# Altium schematic sheet РЕУН.468172.001_Step-Down_Controller.SchDoc: =Name-1str
size 594 x 420 mm; SheetNumber: 3; Вид изделия: Документация; Раздел: Документация; Код документа: Э3; Вид документа: Схема электрическая принципиальная; Класс документа: Конструкторский документ; Создавать изделие в PLM: Yes; DocumentCode: РЕУН.468172.001Э3; DocumentView: Схема электрическая принципиальная; DocumentClass: Конструкторский документ; ProductView: Документация; Format: А2
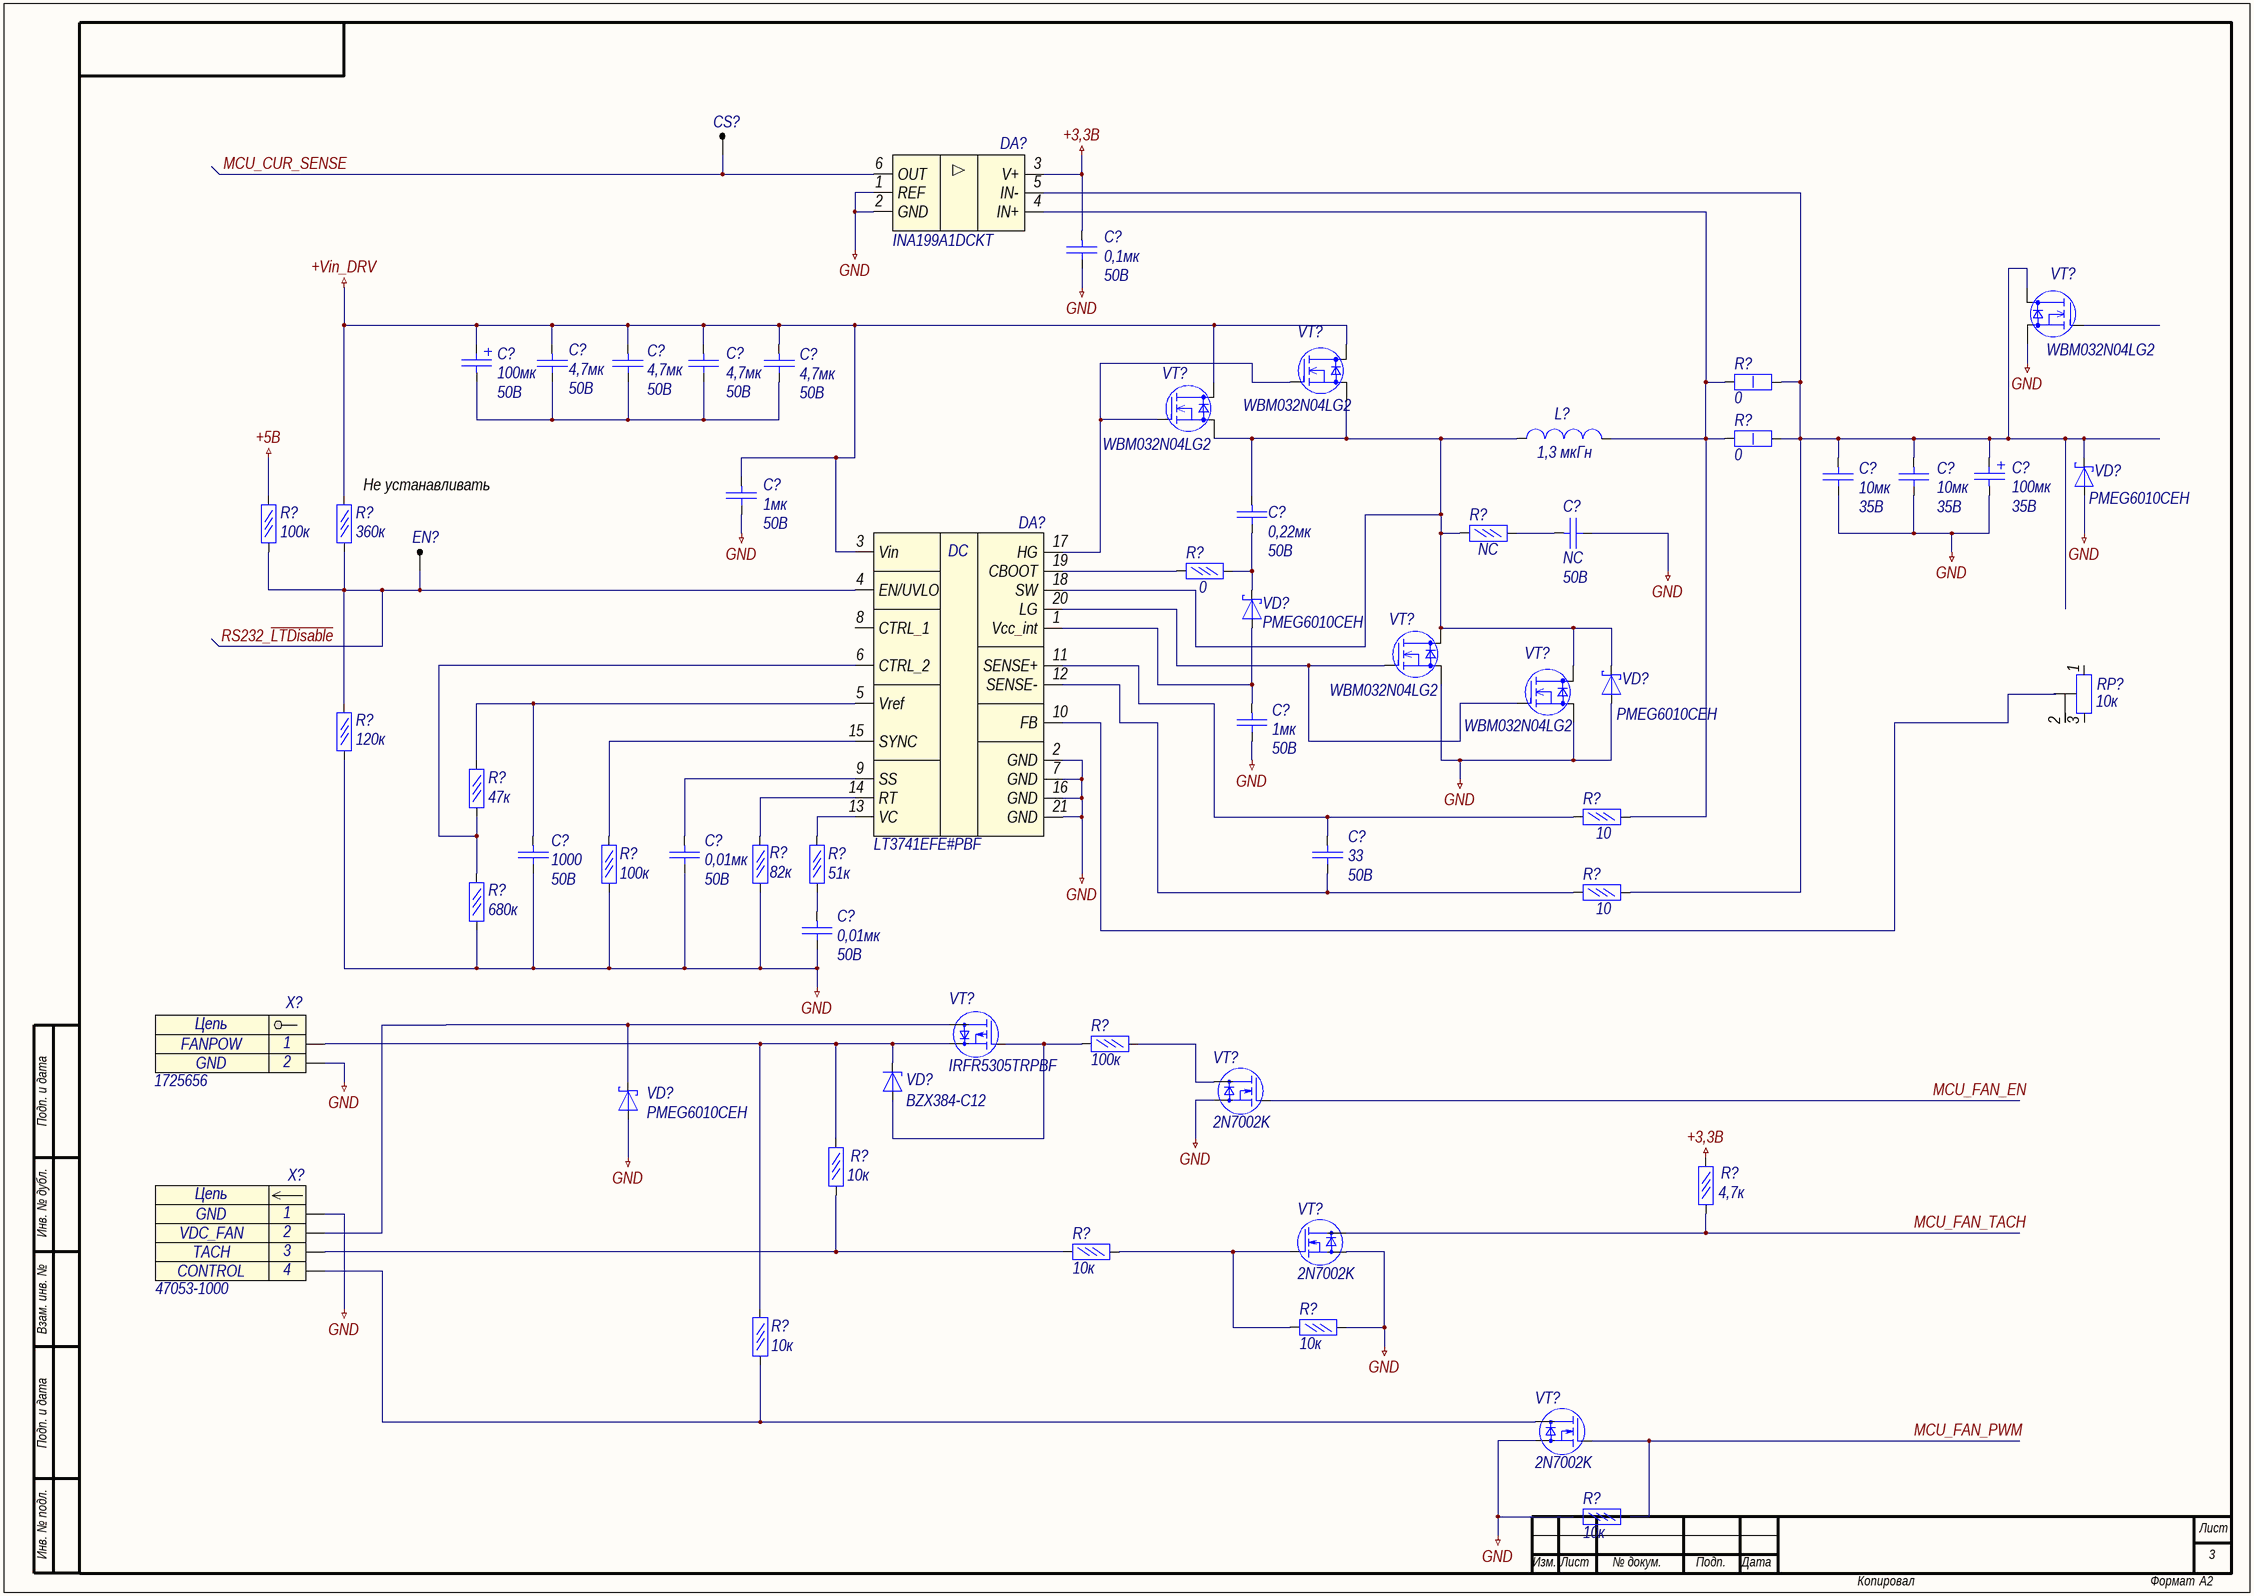
[diagram p0: РЕУН.468172.001_Step-Down_Controller.SchDoc]

## Parts
(Parts that share a designator on the sheet are numbered #1, #2 ... from top to bottom, then left to right.)
C?#1  Voltage: 50В  [C0805_AA]  (hidden comment: 0,1мк)
C?#2  Voltage: 50В  [C0805_AA]  (hidden comment: 100мк)
C?#3  Voltage: 50В  [C0805_AA]  (hidden comment: 4,7мк)
C?#4  Voltage: 50В  [C0805_AA]  (hidden comment: 4,7мк)
C?#5  Voltage: 50В  [C0805_AA]  (hidden comment: 4,7мк)
C?#6  Voltage: 50В  [C0805_AA]  (hidden comment: 4,7мк)
C?#7  Voltage: 35В  [C0805_AA]  (hidden comment: 100мк)
C?#8  Voltage: 35В  [C0805_AA]  (hidden comment: 10мк)
C?#9  Voltage: 35В  [C0805_AA]  (hidden comment: 10мк)
C?#10  Voltage: 50В  [C0805_AA]  (hidden comment: 1мк)
C?#11  Voltage: 50В  [C0805_AA]  (hidden comment: 0,22мк)
C?#12  Voltage: 50В  [C0805_AA]  (hidden comment: NC)
C?#13  Voltage: 50В  [C0805_AA]  (hidden comment: 1мк)
C?#14  Voltage: 50В  [C0805_AA]  (hidden comment: 1000)
C?#15  Voltage: 50В  [C0805_AA]  (hidden comment: 0,01мк)
C?#16  Voltage: 50В  [C0805_AA]  (hidden comment: 33)
C?#17  Voltage: 50В  [C0805_AA]  (hidden comment: 0,01мк)
CS?  "1"  [0.5 x 1_round]  (value not drawn)
DA?#1  INA199A1DCKT
DA?#2  LT3741EFE#PBF
EN?  "1"  [0.5 x 1_round]  (value not drawn)
L?  1,3 мкГн  [L0603_A]
R?#1  0  [R1206]
R?#2  0  [R1206]
R?#3  NC  [R1206]
R?#4  100к  [R1206]
R?#5  360к  [R1206]
R?#6  0  [R1206]
R?#7  120к  [R1206]
R?#8  47к  [R1206]
R?#9  10  [R1206]
R?#10  100к  [R1206]
R?#11  82к  [R1206]
R?#12  51к  [R1206]
R?#13  10  [R1206]
R?#14  680к  [R1206]
R?#15  100к  [R1206]
R?#16  10к  [R1206]
R?#17  4,7к  [R1206]
R?#18  10к  [R1206]
R?#19  10к  [R1206]
R?#20  10к  [R1206]
R?#21  10к  [R1206]
RP?  10к
VD?#1  PMEG6010CEH  [SOD123_A]
VD?#2  PMEG6010CEH  [SOD123_A]
VD?#3  PMEG6010CEH  [SOD123_A]
VD?#4  BZX384-C12  [SOT23-2_A]
VD?#5  PMEG6010CEH  [SOD123_A]
VT?#1  WBM032N04LG2  [КТ-111В-1.02]
VT?#2  WBM032N04LG2  [КТ-111В-1.02]
VT?#3  WBM032N04LG2  [КТ-111В-1.02]
VT?#4  WBM032N04LG2  [КТ-111В-1.02]
VT?#5  WBM032N04LG2  [КТ-111В-1.02]
VT?#6  IRFR5305TRPBF
VT?#7  2N7002K  [SOT23-3]
VT?#8  2N7002K  [SOT23-3]
VT?#9  2N7002K  [SOT23-3]
X?#1  1725656
X?#2  47053-1000

## Nets
+3,3В: C?#1.2 DA?#1.3(V+) R?#17.2
+5В: R?#4.2
+Vin_DRV: C?#2.1 C?#3.2 C?#4.2 C?#5.2 C?#6.2 C?#10.2 DA?#2.3(Vin) R?#5.2 VT?#2.3(D) VT?#3.3(D)
GND: C?#1.1 C?#7.2 C?#8.1 C?#9.1 C?#10.1 C?#12.1 C?#13.1 C?#14.1 C?#15.1 C?#17.1 DA?#1.1(REF) DA?#1.2(GND) DA?#2.2(GND) DA?#2.7(GND) DA?#2.16(GND) DA?#2.21(GND) R?#7.1 R?#10.1 R?#11.1 R?#14.1 R?#19.1 R?#21.2 VD?#1.2(A) VD?#3.2(A) VD?#5.2(A) VT?#1.2(S) VT?#4.2(S) VT?#5.2(S) VT?#7.2(S) VT?#8.2(S) VT?#9.2(S) X?#1.2 X?#2.1
MCU_CUR_SENSE: CS?.1 DA?#1.6(OUT)
MCU_FAN_EN: VT?#7.1(G)
MCU_FAN_PWM: R?#21.1 VT?#9.1(G)
MCU_FAN_TACH: R?#17.1 VT?#8.3(D)
RS232_~{LTDisable}: DA?#2.4(EN/UVLO) EN?.1 R?#4.1 R?#5.1 R?#7.2
NetC?#2_2: C?#2.2 C?#3.1 C?#4.1 C?#5.1 C?#6.1
NetC?#7_1: C?#7.1 C?#8.2 C?#9.2 DA?#1.5(IN-) R?#1.2 R?#2.2 R?#13.2 VD?#1.1(K) VT?#1.3(D)
NetC?#11_1: C?#11.1 R?#6.2 VD?#2.1(K)
NetC?#11_2: C?#11.2 DA?#2.18(SW) L?.1 R?#3.1 VD?#3.1(K) VT?#2.2(S) VT?#3.2(S) VT?#4.3(D) VT?#5.3(D)
NetC?#12_2: C?#12.2 R?#3.2
NetC?#13_2: C?#13.2 DA?#2.1(Vcc_int) VD?#2.2(A)
NetC?#14_2: C?#14.2 DA?#2.5(Vref) R?#8.2
NetC?#15_2: C?#15.2 DA?#2.9(SS)
NetC?#16_1: C?#16.1 DA?#2.12(SENSE-) R?#13.1
NetC?#16_2: C?#16.2 DA?#2.11(SENSE+) R?#9.1
NetC?#17_2: C?#17.2 R?#12.1
NetDA?#1_4: DA?#1.4(IN+) L?.2 R?#1.1 R?#2.1 R?#9.2
NetDA?#2_6: DA?#2.6(CTRL_2) R?#8.1 R?#14.2
NetDA?#2_13: DA?#2.13(VC) R?#12.2
NetDA?#2_14: DA?#2.14(RT) R?#11.2
NetDA?#2_15: DA?#2.15(SYNC) R?#10.2
NetDA?#2_17: DA?#2.17(HG) VT?#2.1(G) VT?#3.1(G)
NetDA?#2_19: DA?#2.19(CBOOT) R?#6.1
NetDA?#2_20: DA?#2.20(LG) VT?#4.1(G) VT?#5.1(G)
NetR?#15_1: R?#15.1 VD?#4.2(A) VT?#6.1(G)
NetR?#15_2: R?#15.2 VT?#7.3(D)
NetR?#16_1: R?#16.1 R?#18.1 X?#2.3
NetR?#16_2: R?#16.2 R?#20.2 VD?#4.1(K) VT?#6.2(S) X?#1.1
NetR?#18_2: R?#18.2 R?#19.2 VT?#8.1(G)
NetR?#20_1: R?#20.1 VT?#9.3(D) X?#2.4
NetVD?#5_1: VD?#5.1(K) VT?#6.3(D) X?#2.2

Not connected (* = marked no-connect by the designer): DA?#2 8(CTRL_1) 10(FB); RP? 1 2 3; VT?#1 1(G)

## Notes on the sheet
- (near R?#5) Не устанавливать
- Подп. и дата
- Инв. № дубл.
- Взам. инв. №
- Инв. № подл.
- Лист
- Изм.
- № докум.
- Подп.
- Дата
- Копировал
- Формат
- (in symbol LT3741) DC
- (in symbol x1-k_1) Цепь
- (in symbol x10-m_1) Цепь

## Library data of the parts
C?#1 = Конденсатор кер.: Name: CC0603KRX7R9BB104; Value: 0,1мк
C?#2 = Конденсатор поляризованный: Конденсатор пол.; Name: EEHZC1H101P; Value: 100мк
C?#3-C?#6 = Конденсатор кер.: Name: C1210C475K5RACTU; Value: 4,7мк
C?#7 = Конденсатор поляризованный: Конденсатор пол.; Name: EEE-FP1A221AP; Value: 100мк
C?#8 C?#9 = Конденсатор кер.: Name: C1210C476M4PACTU; Value: 10мк
C?#10 C?#13 = Конденсатор кер.: Name: 08055D105KAT2A; Value: 1мк
C?#11 C?#12 = Конденсатор кер.: Name: CC0603ZRY5V9BB224
  C?#11: Value: 0,22мк
  C?#12: Value: NC
C?#14 = Конденсатор кер.: Name: CC0603KRX7R9BB102; Value: 1000
C?#15 C?#17 = Конденсатор кер.: Name: CC0603KRX7R9BB103; Value: 0,01мк
C?#16 = Конденсатор кер.: Name: CC0603KRX7R9BB333; Value: 33
CS? EN? = TestPoint: Test point; Comment_1: "1"
DA?#1 = INA199: Voltage output current shunt monitor
DA?#2 = LT3741: Step-Down Controller, Constant Voltage
L? = Inductor: Катушка индуктивности; Name: 7443551130; Value: 1,3 мкГн
R?#1 R?#2 = Резистор  1Вт: Name: CRCW2512100KFKEG; Power rating: 1Вт; Value: 0
R?#3 = Резистор  0,05Вт: Резистор 0,05Вт; Name: RC0603FR-0710RL; Power rating: 0,05Вт; Value: NC
R?#4 R?#5 = Резистор  0,05Вт: Резистор 0,05Вт; Name: RC0603FR-07360KL; Power rating: 0,05Вт
  R?#4: Value: 100к
  R?#5: Value: 360к
R?#6 R?#9 R?#13 R?#14 = Резистор  0,05Вт: Резистор 0,05Вт; Name: RC0603FR-07680KL; Power rating: 0,05Вт
  R?#6: Value: 0
  R?#9 R?#13: Value: 10
  R?#14: Value: 680к
R?#7 = Резистор  0,05Вт: Резистор 0,05Вт; Name: RC0603FR-07120KL; Power rating: 0,05Вт; Value: 120к
R?#8 = Резистор  0,05Вт: Резистор 0,05Вт; Name: RC0603FR-0745K3L; Power rating: 0,05Вт; Value: 47к
R?#10 R?#11 R?#15 = Резистор  0,05Вт: Резистор 0,05Вт; Name: RC0603FR-07100KL; Power rating: 0,05Вт
  R?#10 R?#15: Value: 100к
  R?#11: Value: 82к
R?#12 = Резистор  0,05Вт: Резистор 0,05Вт; Name: RT0603DRD0765K5L; Power rating: 0,05Вт; Value: 51к
R?#16 R?#18-R?#21 = Резистор  0,05Вт: Резистор 0,05Вт; Name: RC0603FR-0710KL; Power rating: 0,05Вт; Value: 10к
R?#17 = Резистор  0,05Вт: Резистор 0,05Вт; Name: RC0603FR-074K7L; Power rating: 0,05Вт; Value: 4,7к
RP? = Potentiometer
VD?#1-VD?#3 VD?#5 = DiodeSchottky: Диод Шоттки; Name: PMEG6010CEH
VD?#4 = DiodeZener: Стабилитрон; Name: BZX384-C12
VT?#1-VT?#5 = N-Mosfet: N-канальный транзистор; Vgs: *; Rds: *; Vds: *; Name: WBM032N04LG2
VT?#6 = mosfet-p-1-3-2: Полевой P-канальный транзистор; Name: IRFR5305TRPBF
VT?#7-VT?#9 = mosfet-n: Name: 2N7002K
X?#1 = x1-k_1: Разъем - 1 конт. клемма; Contact_1: FANPOW; Contact_2: GND; Name: 1725656
X?#2 = x10-m_1: Разъем - 10 конт. вилка; Contact_1: GND; Contact_2: VDC_FAN; Contact_3: TACH; Contact_4: CONTROL; Contact_5: Contact_5; Contact_6: Contact_6; Contact_7: Contact_7; Contact_8: Contact_8; Name: 47053-1000